# EAGLE design ESP_HOME_ligh (EAGLE 9.7.0)
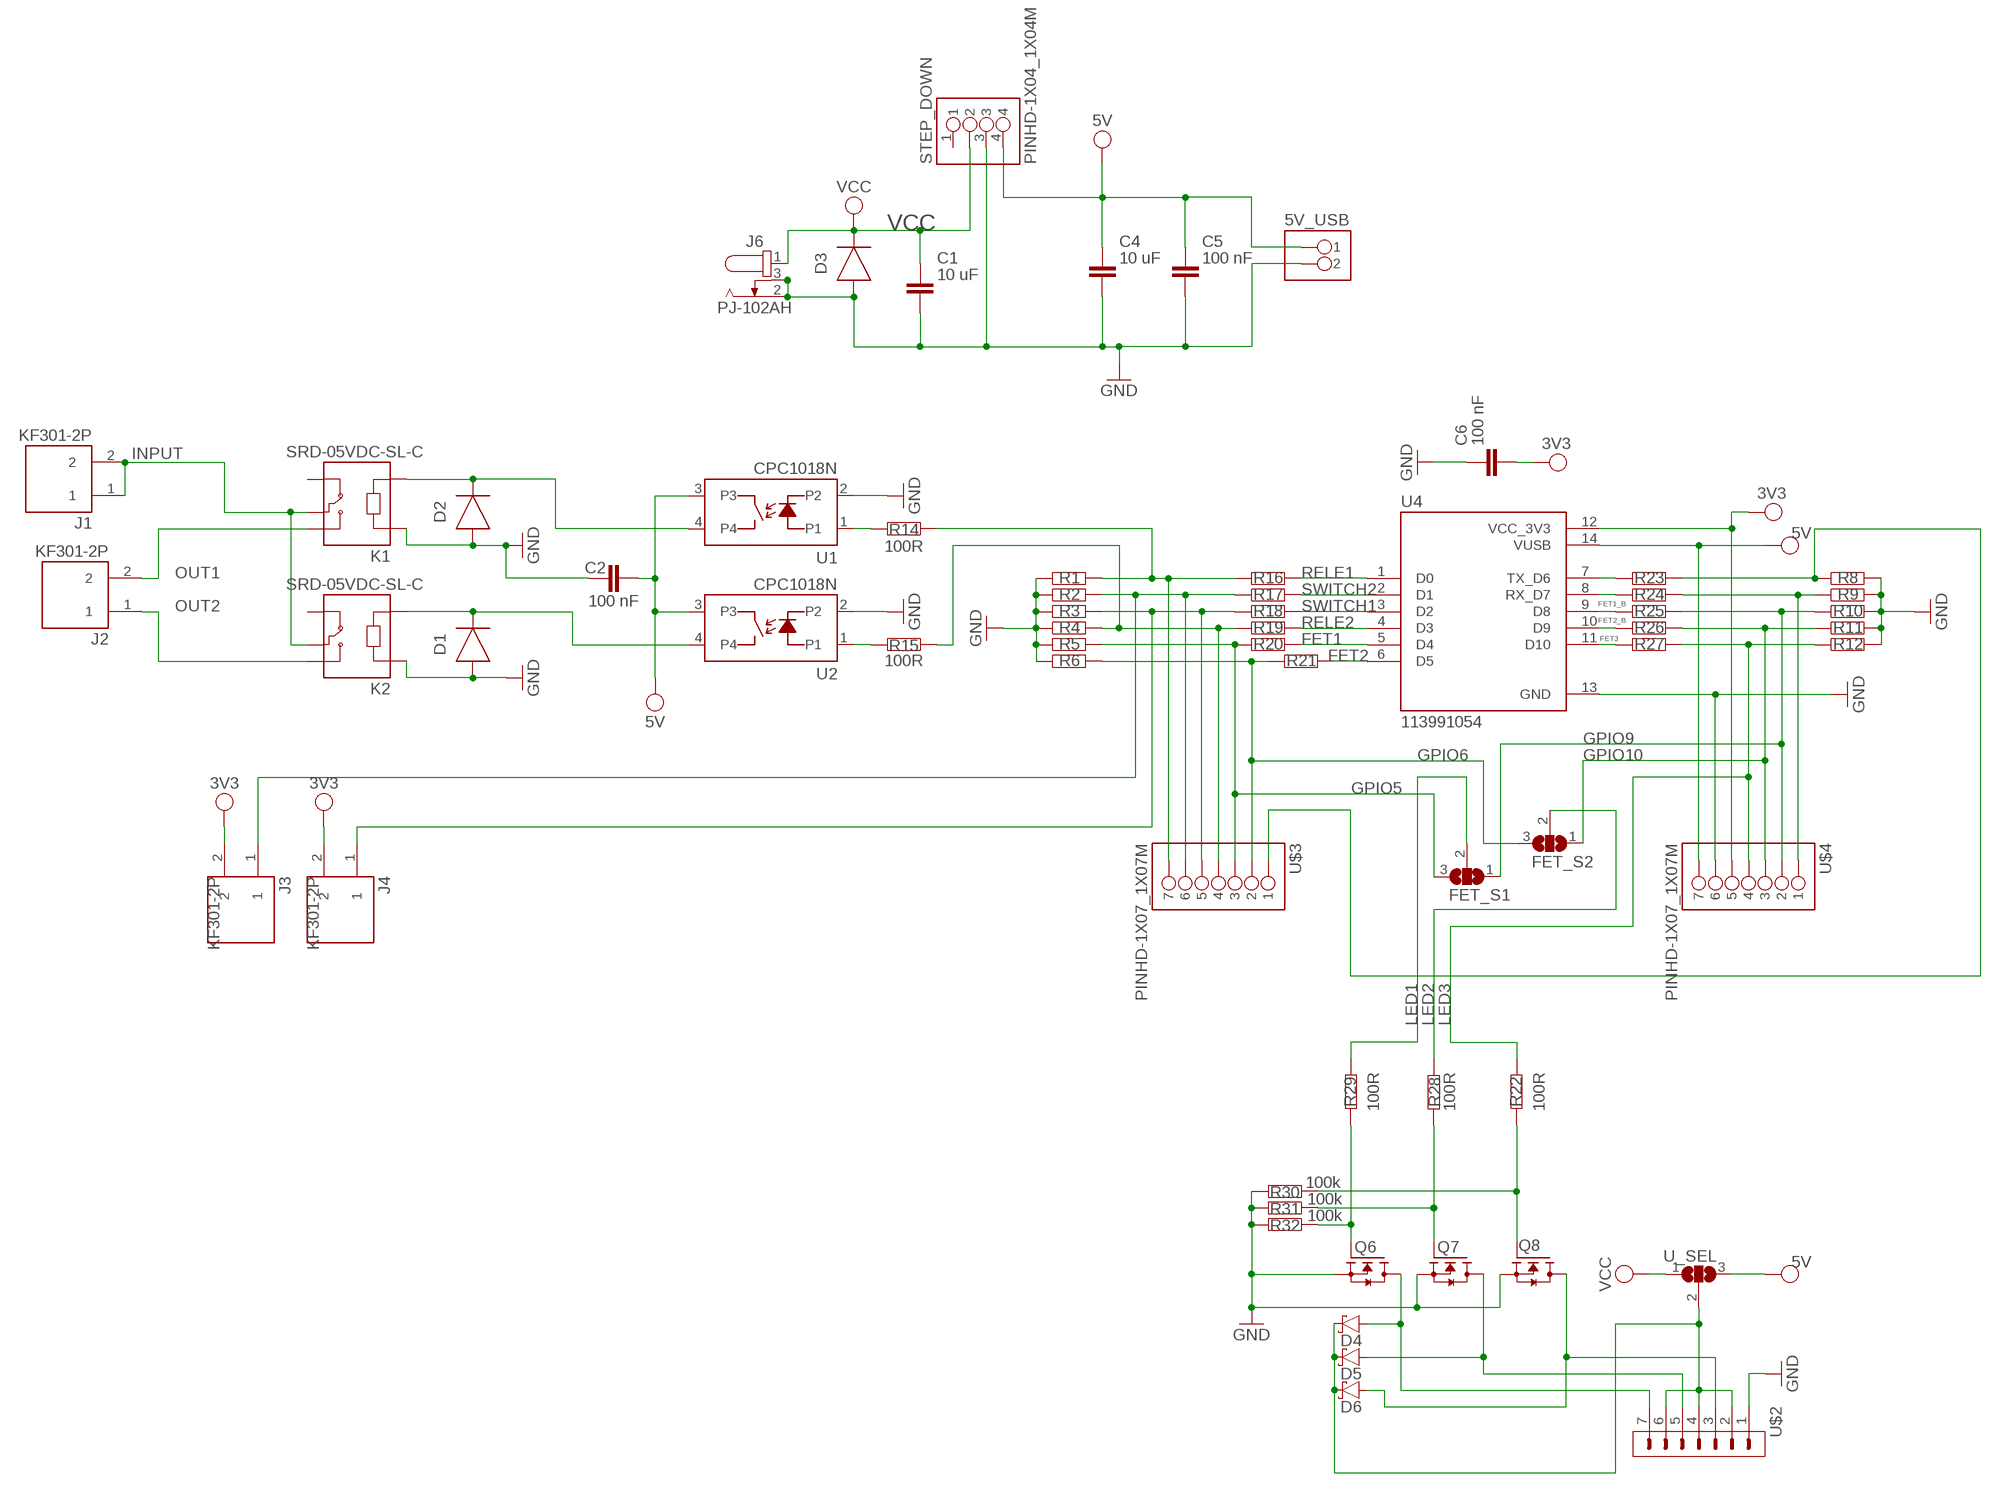
[diagram p0: schematic, sheet 1]

## Parts
5V_USB  PINHD-1X02_1X02M  [1X02]
C1  10 uF  C_CHIP-0805(2012-METRIC)  [CAPC2012X110]
C2  100 nF  C_CHIP-0805(2012-METRIC)  [CAPC2012X110]
C4  10 uF  C_CHIP-0805(2012-METRIC)  [CAPC2012X110]
C5  100 nF  C_CHIP-0805(2012-METRIC)  [CAPC2012X110]
C6  100 nF  C_CHIP-0805(2012-METRIC)  [CAPC2012X110]
D1  DIODEDIODE-AXIAL  [DIODE-AXIAL]
D2  DIODEDIODE-AXIAL  [DIODE-AXIAL]
D3  DIODEDIODE-AXIAL  [DIODE-AXIAL]
D4  SCHOTTKY_MBR0520LT1GDO-219  [SODFL3718X115]
D5  SCHOTTKY_MBR0520LT1GDO-219  [SODFL3718X115]
D6  SCHOTTKY_MBR0520LT1GDO-219  [SODFL3718X115]
FET_S1  SJ2W  [SJ_2]
FET_S2  SJ2W  [SJ_2]
J1  KF301-2P  [HANDSON_KF301-2P]
J2  KF301-2P  [HANDSON_KF301-2P]
J3  KF301-2P  [HANDSON_KF301-2P]
J4  KF301-2P  [HANDSON_KF301-2P]
J6  PJ-102AH  [PJ-102AH]
K1  SRD-05VDC-SL-C  [RELAY_SRD-05VDC-SL-C]
K2  SRD-05VDC-SL-C  [RELAY_SRD-05VDC-SL-C]
Q6  AO3400A  [SOT95P280X125-3N]
Q7  AO3400A  [SOT95P280X125-3N]
Q8  AO3400A  [SOT95P280X125-3N]
R1  R_CHIP-1206(3216-METRIC)  [RESC3216X70]
R2  R_CHIP-1206(3216-METRIC)  [RESC3216X70]
R3  R_CHIP-1206(3216-METRIC)  [RESC3216X70]
R4  R_CHIP-1206(3216-METRIC)  [RESC3216X70]
R5  R_CHIP-1206(3216-METRIC)  [RESC3216X70]
R6  R_CHIP-1206(3216-METRIC)  [RESC3216X70]
R8  R_CHIP-1206(3216-METRIC)  [RESC3216X70]
R9  R_CHIP-1206(3216-METRIC)  [RESC3216X70]
R10  R_CHIP-1206(3216-METRIC)  [RESC3216X70]
R11  R_CHIP-1206(3216-METRIC)  [RESC3216X70]
R12  R_CHIP-1206(3216-METRIC)  [RESC3216X70]
R14  100R  R_CHIP-1206(3216-METRIC)  [RESC3216X70]
R15  100R  R_CHIP-1206(3216-METRIC)  [RESC3216X70]
R16  R_CHIP-1206(3216-METRIC)  [RESC3216X70]
R17  R_CHIP-1206(3216-METRIC)  [RESC3216X70]
R18  R_CHIP-1206(3216-METRIC)  [RESC3216X70]
R19  R_CHIP-1206(3216-METRIC)  [RESC3216X70]
R20  R_CHIP-1206(3216-METRIC)  [RESC3216X70]
R21  R_CHIP-1206(3216-METRIC)  [RESC3216X70]
R22  100R  R_CHIP-1206(3216-METRIC)  [RESC3216X70]
R23  R_CHIP-1206(3216-METRIC)  [RESC3216X70]
R24  R_CHIP-1206(3216-METRIC)  [RESC3216X70]
R25  R_CHIP-1206(3216-METRIC)  [RESC3216X70]
R26  R_CHIP-1206(3216-METRIC)  [RESC3216X70]
R27  R_CHIP-1206(3216-METRIC)  [RESC3216X70]
R28  100R  R_CHIP-1206(3216-METRIC)  [RESC3216X70]
R29  100R  R_CHIP-1206(3216-METRIC)  [RESC3216X70]
R30  100k  R_CHIP-1206(3216-METRIC)  [RESC3216X70]
R31  100k  R_CHIP-1206(3216-METRIC)  [RESC3216X70]
R32  100k  R_CHIP-1206(3216-METRIC)  [RESC3216X70]
STEP_DOWN  PINHD-1X04_1X04M  [1X04]
U1  CPC1018N  [CLARE_SO4]
U2  CPC1018N  [CLARE_SO4]
U4  113991054  [MODULE_113991054]
U$2  PINHD-1X7  [1X07]
U$3  PINHD-1X07_1X07M  [1X07]
U$4  PINHD-1X07_1X07M  [1X07]
U_SEL  SJ2W  [SJ_2]

## Nets
3V3: C6.2 J3.2 J4.2 U4.12(VCC_3V3) U$4.5
5V: 5V_USB.1 C2.2 C4.1 C5.1 STEP_DOWN.4 U1.3 U2.3 U4.14(VUSB) U$4.7 U_SEL.3
FET1: R20.2 U4.5(D4)
FET1_B: R25.1 U4.9(D8)
FET2: R21.2 U4.6(D5)
FET2_B: R26.1 U4.10(D9)
FET3: R27.1 U4.11(D10)
GND: 5V_USB.2 C1.2 C2.1 C4.2 C5.2 C6.1 D1.1(A) D2.1(A) D3.1(A) J6.2 J6.3 K1.A1 K2.A1 Q6.2(S) Q7.2(S) Q8.2(S) R1.1 R2.1 R3.1 R4.1 R5.1 R6.1 R8.2 R9.2 R10.2 R11.2 R12.2 R30.2 R31.2 R32.2 STEP_DOWN.3 U1.2 U2.2 U4.13(GND) U$2.1 U$4.6
GPIO5: FET_S1.3 R5.2 R20.1 U$3.3
GPIO6: FET_S2.3 R6.2 R21.1 U$3.2
GPIO9: FET_S1.1 R10.1 R25.2 U$4.2
GPIO10: FET_S2.1 R11.1 R26.2 U$4.3
INPUT: J1.1 J1.2 K1.COM K2.COM
LED1: FET_S1.2 R29.2
LED2: FET_S2.2 R28.1
LED3: R12.1 R22.2 R27.2 U$4.4
N$1: R14.2 U1.1
N$2: D4.2(A) Q6.3(D) U$2.7
N$3: R23.1 U4.7(TX_D6)
N$4: R24.1 U4.8(RX_D7)
N$5: Q6.1(G) R29.1 R32.1
N$6: Q7.1(G) R28.2 R31.1
N$7: Q8.1(G) R22.1 R30.1
N$8: R15.2 U2.1
N$9: D1.2(C) K2.A2 U2.4
N$11: D2.2(C) K1.A2 U1.4
N$13: R9.1 R24.2 U$4.1
N$14: R8.1 R23.2 U$3.1
N$16: R4.2 R15.1 R19.1 U$3.4
N$18: D4.1(C) D5.1(C) D6.1(C) U$2.2 U$2.4 U$2.6 U_SEL.2
N$21: D5.2(A) Q7.3(D) U$2.5
N$22: D6.2(A) Q8.3(D) U$2.3
N$30: R1.2 R14.1 R16.1 U$3.7
OUT1: J2.2 K1.NO
OUT2: J2.1 K2.NO
RELE1: R16.2 U4.1(D0)
RELE2: R19.2 U4.4(D3)
SW1: J3.1 R2.2 R17.1 U$3.6
SW2: J4.1 R3.2 R18.1 U$3.5
SWITCH1: R18.2 U4.3(D2)
SWITCH2: R17.2 U4.2(D1)
VCC: C1.1 D3.2(C) J6.1 STEP_DOWN.2 U_SEL.1
Unconnected: K1.NC K2.NC STEP_DOWN.1

## Library data of the parts
5V_USB = Tinkercad:PINHD-1X02
C1 C2 C4-C6 = Tutorial - Fusion 360:C: Capacitor - Generic; CATEGORY: Capacitor
D1-D3 = Tinkercad:DIODE: Diode Rectifier - Generic
D4-D6 = Diode:SCHOTTKY_: Schottky Diode - Popular Parts; CATEGORY: Diode; DATASHEET: https://www.onsemi.com/download/data-sheet/pdf/mbr0520lt1-d.pdf; DESCRIPTION: Diode 20 V 500mA Surface Mount SOD-123; FORWARD_CURRENT: 500mA; FORWARD_VOLTAGE: 385mV; MANUFACTURER: onsemi; MPN: MBR0520LT1G; OPERATING_TEMPERATURE: -65°C ~ 125°C; PACKAGE_SIZE: SOD-123; PACKAGE_TYPE: Surface Mount; PART_STATUS: Active; REVERSE_VOLTAGE: 20V; ROHS: Compliant; SERIES: MBR0520; SUBCATEGORY: Schottky Diodes; TYPE: Schottky Power Rectifier; ZENER_VOLTAGE: NA
FET_S1 FET_S2 U_SEL = jumper:SJ2W: SMD solder JUMPER
J1-J4 = KF301-2P:KF301-2P: Check availability <https://pricing.snapeda.com/parts/KF301-2P/Handson%20Technology/view-part?ref=eda>; AVAILABILITY: Not in stock; CHECK_PRICES: https://www.snapeda.com/parts/KF301-2P/Handson+Technology/view-part/?ref=eda; DESCRIPTION: 2 Pin Terminal Block 5mm Pitch; MF: Handson Technology; MP: KF301-2P; PACKAGE: None; PRICE: None; SNAPEDA_LINK: https://www.snapeda.com/parts/KF301-2P/Handson+Technology/view-part/?ref=snap
J6 = Connector:PJ-102AH: 2.0 x 6.5 mm, 5.0 A, Horizontal, Through Hole, Tapered Pins, Dc Power Jack Connector Reference: Datasheet <https://www.sameskydevices.com/product/resource/pj-102ah.pdf>; CATEGORY: Connectors; DATASHEET: https://www.sameskydevices.com/product/resource/pj-102ah.pdf; DESCRIPTION: Power Barrel Connector Jack 2.00mm ID (0.079") & 5.50mm OD (0.217") Through Hole & Right Angle; MANUFACTURER: Same Sky; MPN: PJ-102AH; OPERATING_TEMPERATURE: -25°C ~ 85°C; PACKAGE_SIZE: NA; PACKAGE_TYPE: Through Hole; PART_STATUS: Active; PITCH: NA; ROHS: Compliant; SERIES: PJ-102; SUBCATEGORY: Power Connectors; TYPE: DC Jack Male
K1 K2 = SRD-05VDC-SL-C:SRD-05VDC-SL-C: Check availability <https://pricing.snapeda.com/parts/SRD-05VDC-SL-C/Songle%20Relay/view-part?ref=eda>; AVAILABILITY: In Stock; CHECK_PRICES: https://www.snapeda.com/parts/SRD-05VDC-SL-C/Songle+Relay/view-part/?ref=eda; DESCRIPTION: 5V Trigger Relay Module For Arduino And Raspberry Pi 5V Trigger Relay Module For Arduino And Raspberry Pi; MF: Songle Relay; MP: SRD-05VDC-SL-C; PACKAGE: NON STANDARD-5 Songle Relay; PRICE: None; SNAPEDA_LINK: https://www.snapeda.com/parts/SRD-05VDC-SL-C/Songle+Relay/view-part/?ref=snap
Q6-Q8 = AO3400A:AO3400A: Check availability <https://pricing.snapeda.com/parts/AO3400A/Alpha%20%26%20Omega%20Semiconductor/view-part?ref=eda>; AVAILABILITY: In Stock; CHECK_PRICES: https://www.snapeda.com/parts/AO3400A/Alpha/view-part/?ref=eda; DESCRIPTION: N-Channel 30 V 5.7A (Ta) 1.4W (Ta) Surface Mount SOT-23-3; MF: Alpha & Omega Semiconductor; MP: AO3400A; PACKAGE: SOT-23 Alpha &amp; Omega Semiconductor Inc.; PRICE: None; SNAPEDA_LINK: https://www.snapeda.com/parts/AO3400A/Alpha/view-part/?ref=snap
R1-R6 R8-R12 R14-R32 = Resistor:R: Resistor Fixed - Generic; CATEGORY: Resistors; DESCRIPTION: Chip Resistor 3.20 X 1.60 X 0.70 mm body 1206(3216-METRIC) Package; PACKAGE_SIZE: 1206; PACKAGE_TYPE: Surface Mount
STEP_DOWN = Tinkercad:PINHD-1X04
U1 U2 = CPC1018N:CPC1018N: Check availability <https://pricing.snapeda.com/parts/CPC1018N/IXYS%20Integrated%20Circuits/view-part?ref=eda>; AVAILABILITY: In Stock; CHECK_PRICES: https://www.snapeda.com/parts/CPC1018N/IXYS/view-part/?ref=eda; DESCRIPTION: Solid State Photo-Coupled Relay (Photorelay) SPST-NO (1 Form A) 4-SOP (0.150, 3.81mm); MF: IXYS Integrated Circuits; MP: CPC1018N; PACKAGE: SOP-4 Ixys Corporation; PRICE: None; SNAPEDA_LINK: https://www.snapeda.com/parts/CPC1018N/IXYS/view-part/?ref=snap
U4 = esp32c3_seeed:113991054: Check availability <https://pricing.snapeda.com/parts/113991054/Seeed%20Technology%20Co.%2C%20Ltd/view-part?ref=eda>; AVAILABILITY: In Stock; CHECK_PRICES: https://www.snapeda.com/parts/113991054/Seeed+Studio/view-part/?ref=eda; DESCRIPTION: - ESP32-C3 Transceiver; 802.11 a/b/g/n (Wi-Fi, WiFi, WLAN), Bluetooth® Smart 4.x Low Energy (BLE) 2.4GHz Evaluation Board; MF: Seeed Technology Co., Ltd; MP: 113991054; PACKAGE: None; PRICE: None; SNAPEDA_LINK: https://www.snapeda.com/parts/113991054/Seeed+Studio/view-part/?ref=snap
U$2 = Connector:PINHD-1X7: Pin Header; CATEGORY: Connectors; DESCRIPTION: Header-Straight-7 Position; PACKAGE_TYPE: Through Hole; PITCH: 0.100" (2.54mm); SUBCATEGORY: Headers; TYPE: Male Pins
U$3 U$4 = Tinkercad:PINHD-1X07

## Board
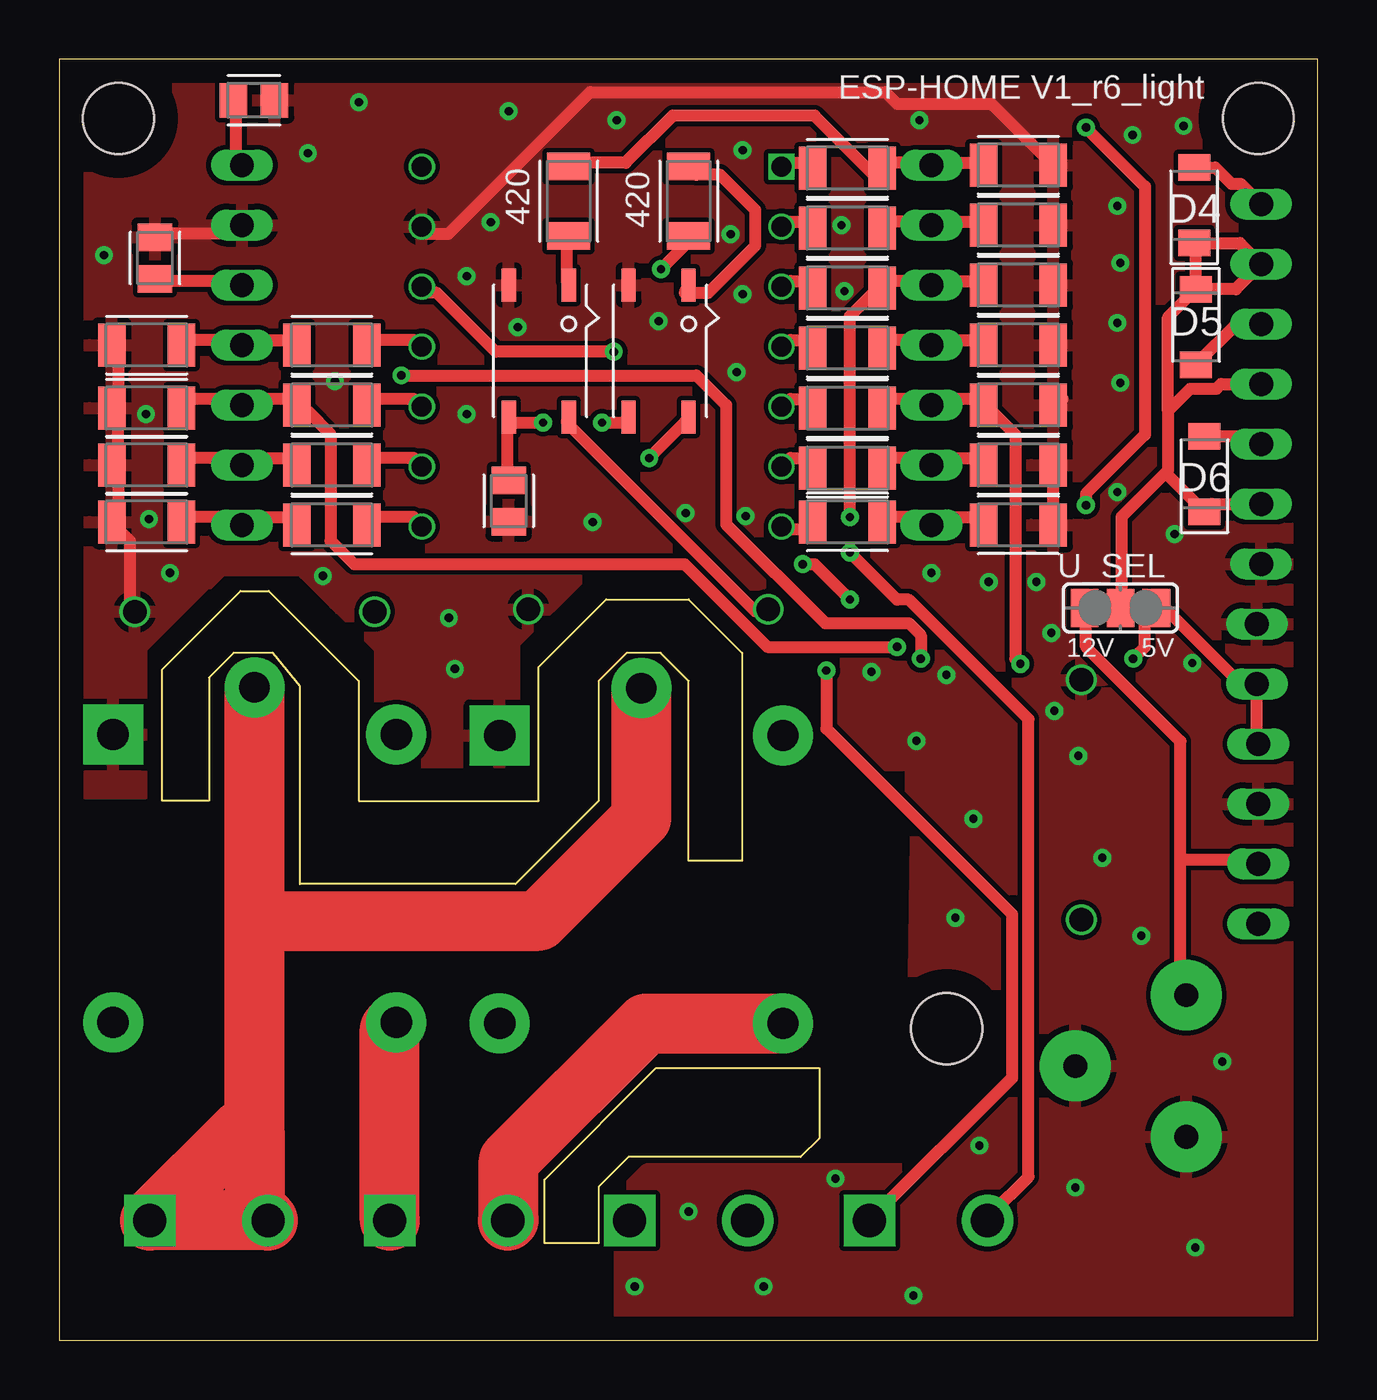
[diagram p1: board, top side]
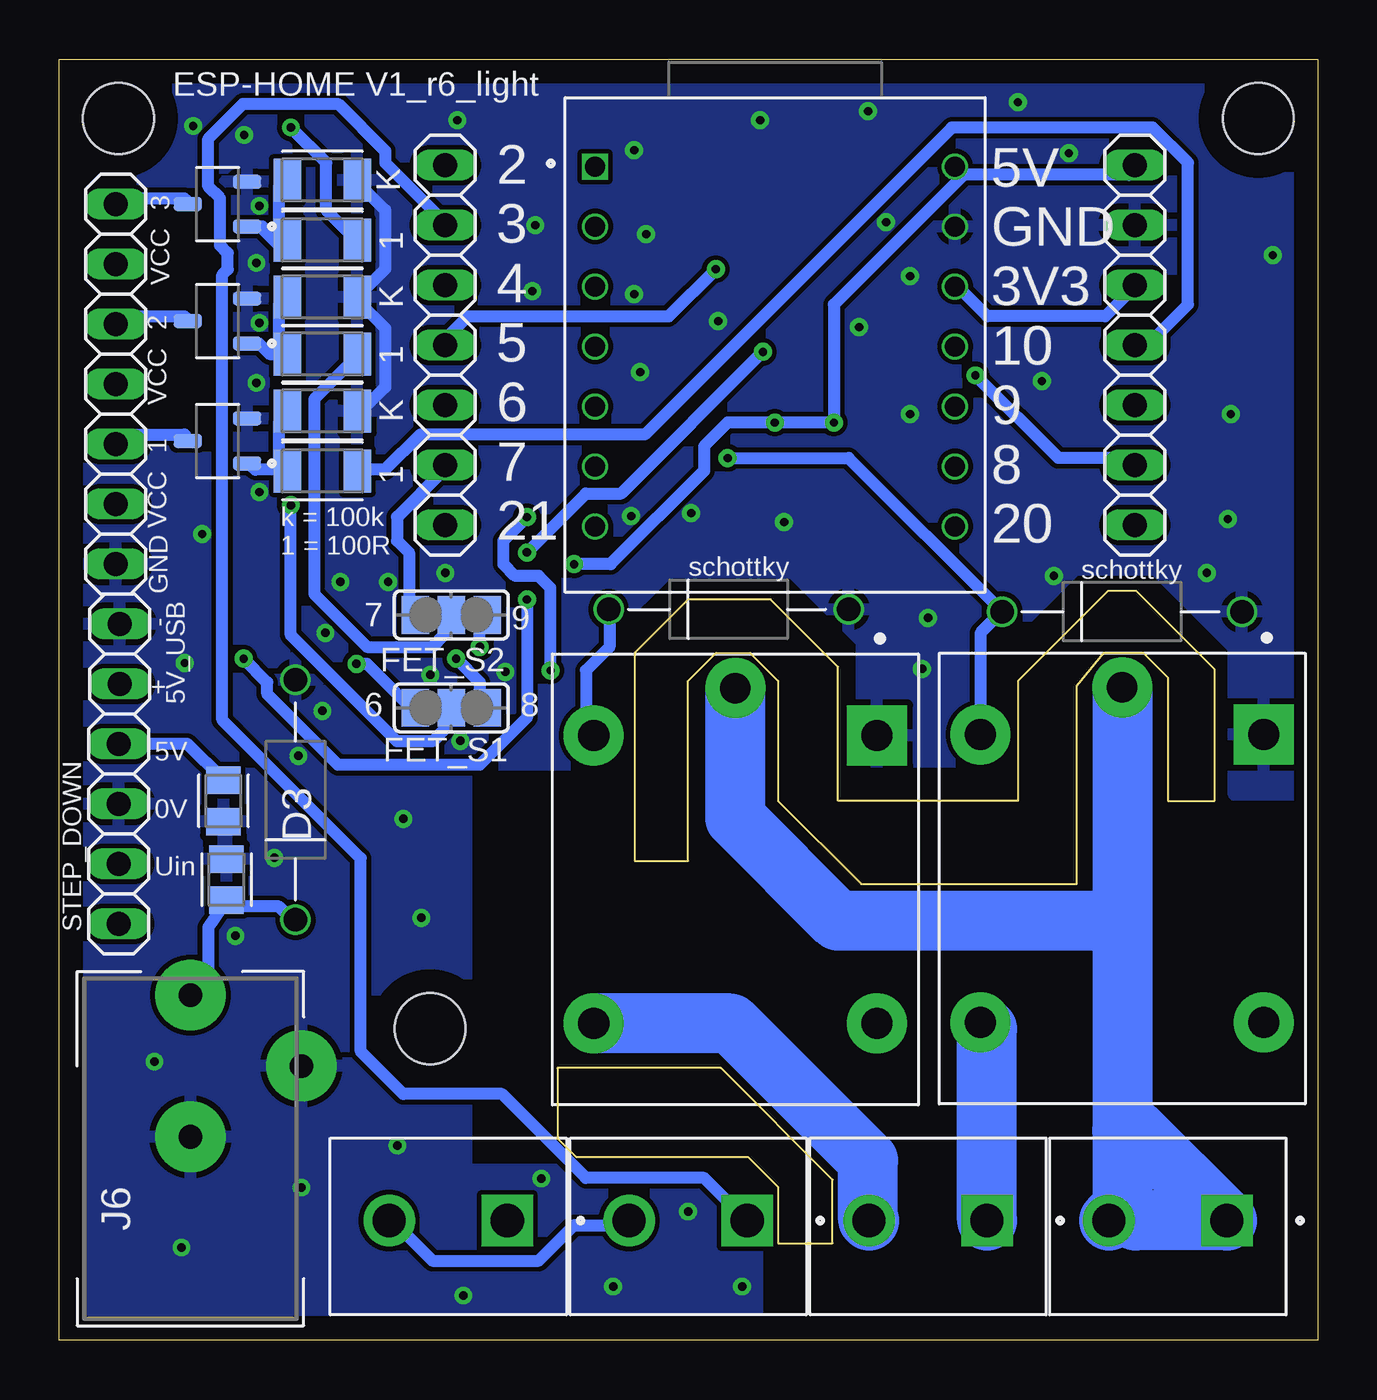
[diagram p2: board, bottom side, seen from below]

Size 53.32 x 54.28 mm. Coordinates in mm from the lower left corner, seen from the top.
Outline: 0,0 53.32,0 53.32,54.28 0,54.28 0,0
Copper layers (1*16): Top 0.035mm / dielectric 1.5mm / Bottom 0.035mm
Design rules "Fusion Electronics Design Rules *": minimum track width 0.2mm, minimum drill 0.35mm, track to track 0.2mm, track to pad 0.2mm, pad to pad 6mil, via to via 6mil, smd to smd 6mil, copper to edge 40mil, drill to drill 6mil, minimum pad ring 0.1mm, minimum via ring 0.204mm, stop-mask expansion 4mil, vias tented up to drill 9999mil, thermal gap 10mil
Holes 3 mm at 2.52,51.76 50.8,51.76 37.6,13.21
tRestrict: 25 lines
Milling: 34 lines

### Footprints (pad centres in the part's own frame; a part is rotated, then mirrored left to right if it is on the bottom)
1X02 = drill 1.016 long: 1 -1.27,0; 2 1.27,0
CAPC2012X110 = smd 1.165 x 1.465: 1 -0.875,0; 2 0.875,0
DIODE-AXIAL = drill 1: 1 -5.08,0; 2 5.08,0
SODFL3718X115 = smd 1.115 x 1.361: 1 -1.6,0; 2 1.6,0
SJ_2 = smd 1.168 x 1.6: 1 -1.524,0; 2 0,0; 3 1.524,0
HANDSON_KF301-2P = drill 1.4 pad 2.184 square: 1 -2.5,0 | drill 1.4 pad 2.184: 2 2.5,0
PJ-102AH = drill 1 pad 3 slot 2.159 rotated 90: 1 6.5,0; 2 0.5,0 | drill 1 pad 3 slot 2.159: 3 3.5,-4.7
RELAY_SRD-05VDC-SL-C = drill 1.32 pad 2.54 square: A1 -6.1,6 | drill 1.32 pad 2.54: A2 -6.1,-6; NC 6.1,6; NO 6.1,-6 | drill 1.29 pad 2.54: COM -8.1,0
SOT95P280X125-3N = smd 1.21 x 0.59: 1 -1.255,0.95; 2 -1.255,-0.95; 3 1.255,0
RESC3216X70 = smd 1.165 x 1.815: 1 -1.475,0; 2 1.475,0
1X04 = drill 1.016 long: 1 -3.81,0; 2 -1.27,0; 3 1.27,0; 4 3.81,0
CLARE_SO4 = smd 0.6 x 1.4: 1 -1.27,-2.8; 2 1.27,-2.8; 3 1.27,2.8; 4 -1.27,2.8
MODULE_113991054 = drill 0.85 square: 1 -7.62,7.556 | drill 0.85: 2 -7.62,5.016; 3 -7.62,2.477; 4 -7.62,-0.064; 5 -7.62,-2.603; 6 -7.62,-5.144; 7 -7.62,-7.684; 8 7.62,-7.684; 9 7.62,-5.144; 10 7.62,-2.603; 11 7.62,-0.064; 12 7.62,2.477; 13 7.62,5.016; 14 7.62,7.556
1X07 = drill 1.016 long: 1 -7.62,0; 2 -5.08,0; 3 -2.54,0; 4 0,0; 5 2.54,0; 6 5.08,0; 7 7.62,0

### Placement (x,y rotation side)
5V_USB  50.74,29.08 90 bottom
C1  46.23,19.52 90 bottom
C2  19.05,35.56 90 top
C4  46.35,22.86 270 bottom
C5  8.26,52.53 0 top
C6  4.07,45.85 270 top
D1  8.29,30.87 180 bottom
D2  24.96,30.97 180 bottom
D3  43.3,22.9 270 bottom
D4  48.09,48.09 90 top
D5  48.16,42.93 270 top
D6  48.51,36.7 90 top
FET_S1  36.7,26.8 180 bottom
FET_S2  36.7,30.73 180 bottom
J1  6.35,5.08 180 bottom
J2  16.51,5.08 180 bottom
J3  26.67,5.08 180 bottom
J4  36.83,5.08 180 bottom
J6  47.75,8.13 90 bottom
K1  24.67,19.53 270 bottom
K2  8.29,19.57 270 bottom
Q6  46.61,48.13 180 bottom
Q7  46.61,43.18 180 bottom
Q8  46.61,38.1 180 bottom
R1  40.64,49.78 180 top
R2  40.64,47.24 180 top
R3  40.64,44.7 180 top
R4  40.64,42.16 180 top
R5  40.64,39.62 180 top
R6  40.64,37.08 180 top
R8  40.64,34.54 0 top
R9  3.71,34.67 180 top
R10  3.71,37.08 180 top
R11  3.71,39.5 180 top
R12  3.71,42.16 180 top
R14  21.59,48.26 270 top
R15  26.67,48.26 90 top
R16  33.4,49.66 180 top
R17  33.4,47.12 180 top
R18  33.4,44.58 180 top
R19  33.4,42.04 180 top
R20  33.4,39.49 180 top
R21  33.4,36.95 180 top
R22  42.16,36.83 0 bottom
R23  33.4,34.67 0 top
R24  11.56,34.54 180 top
R25  11.56,37.08 180 top
R26  11.56,39.62 180 top
R27  11.56,42.16 180 top
R28  42.16,41.78 180 bottom
R29  42.16,46.61 0 bottom
R30  42.16,39.37 0 bottom
R31  42.17,44.2 0 bottom
R32  42.16,49.15 0 bottom
STEP_DOWN  50.8,21.46 90 bottom
U1  20.32,41.91 180 top
U2  25.4,41.91 180 top
U4  22.99,42.16 0 bottom
U$2  50.92,40.51 90 bottom
U$3  36.96,42.16 90 bottom
U$4  7.75,42.16 90 bottom
U_SEL  44.96,31.03 0 top

### Tracks (layer width: path | path; a pad name or v marks a point on that pad's centre or on a via)
3V3  (via drill 0.35)
  Top 0.5: C6.2 4.5,44.88 7.5,44.88 U$4.5 | v23.5,41.88 18.5,41.88 16,44.38 15.5,44.38 U4.12 | v33.5,33.38 35.5,31.38 36,31.38 41.06,26.32 41.06,6.94 39.5,5.38 J4.2
  Bottom 0.5: U4.12 15,44.38 14,43.38 9,43.38 8,44.38 U$4.5 | J3.2 29.5,4.88 31.5,4.88 33,3.38 37.5,3.38 39,4.88 J4.2 | v23.5,41.88 29.5,35.88 31,35.88 v33.5,33.38
5V  (via drill 0.35)
  Top 0.5: 19,38.88 19,36.88 C2.2 | v23,38.88 24,38.88 U2.3 | 19,38.88 v20.5,38.88 | 19,38.88 U1.3 | C5.1 7.5,52.38 7.5,49.88 U$4.7 | v45.5,28.88 46,29.38 46,30.88 U_SEL.3 46.5,30.88 46.99,30.88 50.06,27.81 5V_USB.1 50.74,25.33 STEP_DOWN.4 | v33.5,31.38 32,32.88 v31.5,32.88
  Bottom 0.5: 15,49.38 8,49.38 U$4.7 | 15,49.38 20.5,43.88 v20.5,38.88 v23,38.88 25,38.88 26,37.88 26,36.84 29.96,32.88 v31.5,32.88 | 15,49.38 U4.14 | v45.5,28.88 44.5,27.88 44.5,27.38 41.5,24.38 35.5,24.38 33.5,26.38 v33.5,31.38 | C4.1 47.89,25.27 STEP_DOWN.4
FET1
  Top 0.5: R20.2 31.5,39.88 31,39.88 U4.5
FET1_B
  Top 0.5: R25.1 13.5,37.38 15,37.38 U4.9
FET2
  Top 0.5: R21.2 31.5,37.38 31,37.38 U4.6
FET2_B
  Top 0.5: R26.1 13.5,39.88 15,39.88 U4.10
FET3
  Top 0.5: R27.1 13.5,42.38 15,42.38 U4.11
GND  (via drill 0.35)
  Top 0.5: R5.1 42.5,39.88 | 42,42.38 R4.1 | R12.2 2.5,41.88 2.5,39.88 R11.2 2.5,39.38 2.5,37.38 R10.2 2.5,36.88 2.5,34.88 R9.2 2.5,34.38 3,33.88 3,30.88 D1.1 | C6.1 4.5,46.88 7.5,46.88 U$4.6 | R1.1 42,49.88 39.5,52.38 35.5,52.38 35,52.88 22.5,52.88 16.5,46.88 15.5,46.88 U4.13 | R8.2 R6.1
  Bottom 0.5: R30.2 40.5,39.38 39.5,40.38 39.5,42.88 40.5,43.88 R31.2 40.5,44.38 39.5,45.38 39.5,47.88 40.5,48.88 R32.2
  other vias: 19.05,52.07 17.27,45.09 17.27,39.24 19.43,42.93 25.4,43.18 28.96,44.32 28.7,41.02 28.45,46.86 28.96,50.42 23.62,51.69 12.7,52.45 1.91,45.97 3.68,39.24 4.7,32.51 16.51,30.61 22.61,34.67 26.54,35.05 32.89,6.86 38.99,8.25 43.05,6.48 48.13,3.94 36.2,1.91 29.84,2.29 24.38,2.29 26.67,5.46 49.28,11.81 45.85,17.14 44.2,20.45 43.18,24.76 38.73,22.1 37.97,17.91 36.32,25.4 36.45,51.69 18.29,47.37 10.54,50.29 11.68,40.64 11.18,32.39 3.81,34.8 16.76,28.45 29.08,34.93 33.15,47.24 33.27,44.45 47.63,51.44 45.47,51.06 48,28.7 39.38,32.13 47.25,34.16 42.16,26.67 44.83,35.94 36.96,32.51 37.59,28.19 34.42,28.32 42.04,29.97 41.4,32.13 44.83,43.1 44.96,45.64 44.83,48.06 44.96,40.56
  pour Top: 36.03,7.35 35.96,7.28 35.86,7.24 24.87,7.24 23.75,6.12 23.75,0.25 53.09,0.25 53.09,54.36 0.25,54.36 0.25,23.11 3.56,23.11 3.56,29.26 3.59,29.35 6.84,32.6 6.93,32.64 10.21,32.64 10.3,32.6 13.55,29.35 13.59,29.26 13.59,24.51 19.3,24.51 19.3,29.51 19.34,29.61 22.21,32.47 22.3,32.51 27.1,32.51 27.19,32.47 29.81,29.86 29.84,29.77 29.84,24.38 35.86,24.38 35.96,24.35 36.03,24.27 36.07,24.18 36.07,7.44
  pour Bottom: 36.03,7.35 35.96,7.28 35.86,7.24 24.87,7.24 23.75,6.12 23.75,0.25 53.09,0.25 53.09,55.63 0.25,55.63 0.25,23.11 3.56,23.11 3.56,29.26 3.59,29.35 6.84,32.6 6.93,32.64 10.21,32.64 10.3,32.6 13.55,29.35 13.59,29.26 13.59,24.51 19.3,24.51 19.3,29.51 19.34,29.61 22.21,32.47 22.3,32.51 27.48,32.51 27.58,32.47 29.81,30.24 29.84,30.15 29.84,24.38 35.86,24.38 35.96,24.35 36.03,24.27 36.07,24.18 36.07,7.44
GPIO5  (via drill 0.35)
  Top 0.5: R20.1 35,39.88 36.5,39.88 U$3.3 37,39.88 39,39.88 R5.2 39.5,39.38 40.5,38.38 40.5,28.88 v40.72,28.66
  Bottom 0.5: FET_S1.3 38.42,26.8 40.28,28.66 v40.72,28.66
GPIO6
  Top 0.5: R21.1 35,37.38 36.5,37.38 U$3.2 37,37.38 39,37.38 R6.2
  Bottom 0.5: FET_S2.3 38.5,30.88 38.5,33.38 39,33.88 39,34.88 37,36.88 U$3.2
GPIO9  (via drill 0.35)
  Top 0.5: v36.5,28.88 36.5,29.88 36,30.38 32.46,30.38 28.25,34.58 28.25,39.63 27,40.88 v14.5,40.88 | R10.1 5.5,37.38 7.5,37.38 U$4.2 8,37.38 10,37.38 R25.2
  Bottom 0.5: v36.5,28.88 35.5,27.88 35.5,26.88 FET_S1.1 | v14.5,40.88 11,37.38 8,37.38 U$4.2
GPIO10  (via drill 0.35)
  Top 0.5: R11.1 5.5,39.88 7.5,39.88 U$4.3 8,39.88 10,39.88 R26.2 10.5,39.38 11.5,38.38 11.5,33.88 12.5,32.88 26.5,32.88 30,29.38 v35.5,29.38
  Bottom 0.5: v35.5,29.38 35.5,30.38 FET_S2.1
INPUT
  Top 2.54: 8.29,8.89 8.29,17.78 | 8.29,17.78 K2.COM | 8.29,8.89 8.29,5.64 J1.2 J1.1 7.66,8.89 8.29,8.89 | 8.29,17.78 20.32,17.78 24.67,22.13 K1.COM
  Bottom 2.54: K2.COM 8.29,17.78 | 8.29,17.78 8.29,8.89 | 8.29,8.89 8.29,5.64 | 8.29,5.64 J1.2 | 8.29,5.64 7.72,5.08 J1.1 7.66,8.89 8.29,8.89 | 8.29,17.78 20.32,17.78 24.67,22.13 K1.COM
LED1  (via drill 0.35)
  Top 0.5: v43.5,35.38 43.5,35.86 46,38.36 46,48.88 v43.5,51.38
  Bottom 0.5: v43.5,35.38 43.5,29.88 39,25.38 37.5,25.38 37,25.88 37,26.38 FET_S1.2 | v43.5,51.38 42,49.88 42,47.88 41,46.88 R29.2
LED2
  Bottom 0.5: FET_S2.2 37,30.38 37,29.88 37.5,29.38 40.27,29.38 42.51,31.62 42.51,39.87 41,41.38 R28.1
LED3
  Top 0.5: R12.1 5.5,42.38 7.5,42.38 U$4.4 8,42.38 10,42.38 R27.2
  Bottom 0.5: R22.2 40.5,36.88 39.5,36.88 38,38.38 28.5,38.38 15.5,51.38 7,51.38 5.5,49.88 5.5,43.88 7.5,41.88 U$4.4
N$1
  Top 0.5: U1.1 21.5,44.88 21.5,46.38 R14.2
N$2
  Top 0.5: D4.2 48.97,49.69 49.66,49 50.05,49 U$2.7
  Bottom 0.5: Q6.3 48,48.38 50.5,48.38 U$2.7
N$3
  Top 0.5: R23.1 31.5,34.38 31,34.38 U4.7
N$4
  Top 0.5: R24.1 13.5,34.88 15,34.88 U4.8
N$5
  Bottom 0.5: Q6.1 44.7,47.18 44.76,47.14 44,46.38 R29.1 44,46.88 44,48.88 R32.1
N$6
  Bottom 0.5: R31.1 44,43.88 44,41.88 R28.2 44.4,41.78 44.85,42.23 Q7.1
N$7
  Bottom 0.5: 44,36.88 45,36.88 Q8.1 | 44,36.88 44,38.88 R30.1 | 44,36.88 R22.1
N$8
  Top 0.5: U2.1 26.5,44.38 27.5,44.38 29.5,46.38 29.5,47.88 28,49.38 27,49.38 R15.2
N$9  (via drill 0.35)
  Top 0.5: v25,37.38 26.5,38.88 U2.4
  Bottom 0.5: v25,37.38 19.88,37.38 D1.2 14.29,29.96 K2.A2
N$11
  Top 0.5: U1.4 21.5,38.88 29.5,30.88 30,30.88 D2.2
  Bottom 0.5: K1.A2 31,25.88 31,28.38 30.01,29.37 30.01,30.9 D2.2
N$13
  Top 0.5: R9.1 5.5,34.88 7.5,34.88 U$4.1 8,34.88 10,34.88 R24.2
N$14
  Top 0.5: R23.2 35,34.88 36.5,34.88 U$3.1 37,34.88 39,34.88 R8.1
N$16  (via drill 0.35)
  Top 0.5: R19.1 35,42.38 36.5,42.38 U$3.4 37,42.38 39,42.38 R4.2 | v25.5,45.38 26.5,46.38 R15.1
  Bottom 0.5: v25.5,45.38 27.5,43.38 36,43.38 37,42.38 U$3.4
N$18
  Top 0.5: 46.97,36.85 45,34.88 45,31.38 U_SEL.2 | D5.1 48.16,46.41 D4.1 50.02,46.48 U$2.6 49.85,44.53 D5.1 | 46.97,39.37 46.97,36.85 | 46.97,39.37 46.97,43.34 D5.1 | U$2.2 48.84,35.43 D6.1 46.97,36.65 46.97,36.85 | 46.97,39.37 47.92,40.32 49.03,40.32 49.22,40.51 U$2.4
N$21
  Top 0.5: D5.2 49.89,43.05 U$2.5
  Bottom 0.5: Q7.3 48,43.38 50.5,43.38 U$2.5
N$22
  Top 0.5: D6.2 50.59,38.3 U$2.3
  Bottom 0.5: Q8.3 48,38.38 50.5,38.38 U$2.3
N$30
  Top 0.5: R14.1 22,49.88 24,49.88 26,51.88 32,51.88 34.5,49.38 R16.1 35,49.88 36.5,49.88 U$3.7 37,49.88 39,49.88 R1.2
OUT1
  Top 2.54: J2.2 19.05,5.12 19.05,7.62 24.86,13.43 K1.NO
  Bottom 2.54: J2.2 19.05,5.12 19.05,7.62 24.86,13.43 K1.NO
OUT2
  Top 2.54: J2.1 14.01,13.19 K2.NO
  Bottom 2.54: J2.1 14.01,13.19 K2.NO
RELE1
  Top 0.5: R16.2 31.5,49.88 31,49.88 U4.1
RELE2
  Top 0.5: R19.2 31.5,42.38 31,42.38 U4.4
SW1
  Top 0.5: R17.1 35,47.38 36.5,47.38 U$3.6 37,47.38 39,47.38 R2.2
  Bottom 0.5: U$3.6 37,47.38 39.5,49.88 39.5,50.38 41.5,52.38 45.52,52.38 47,50.9 47,48.88 46.5,48.38 46.5,46.39 46.17,46.06 46.17,45.38 46.41,45.14 46.41,26.29 40.54,20.42 40.54,12.24 38.74,10.44 34.56,10.44 31,6.88 26,6.88 24.5,5.38 J3.1
SW2  (via drill 0.35)
  Top 0.5: R3.2 39,44.88 37,44.88 U$3.5 36.5,44.88 35,44.88 R18.1 34.5,44.38 33.5,43.38 v33.5,34.88 | v32.5,28.38 32.5,25.92 40.36,18.06 40.36,11.11 J4.1
  Bottom 0.5: v33.5,34.88 34.5,33.88 34.5,32.88 34,32.38 33,32.38 32.5,31.88 v32.5,28.38
SWITCH1
  Top 0.5: R18.2 31.5,44.88 31,44.88 U4.3
SWITCH2
  Top 0.5: R17.2 31.5,47.38 31,47.38 U4.2
VCC
  Top 0.5: 47.5,20.38 47.5,14.88 J6.1 | 47.5,20.38 47.5,25.38 43.5,29.38 43.5,30.88 U_SEL.1 | 47.5,20.38 50.5,20.38 STEP_DOWN.2
  Bottom 0.5: D3.2 43.5,17.88 44,18.38 46.07,18.38 C1.1 47,17.5 47,15.38 J6.1

### Text on the board
tNames: ESP-HOME V1_r6_light | 420 | 420 | 12V | 5V
bNames: ESP-HOME V1_r6_light | K | 1 | 3 | K | VCC | 1 | 2 | K | VCC | 1 | 1 | 2 / 3 / 4 / 5 / 6 / 7 / 21 | VCC | 5V / GND / 3V3 / 10 / 9 / 8 / 20 | k = 100k / 1 = 100R | schottky | schottky | GND | 9 | 7 | + - | 8 | 6 | 5V / / 0V / / Uin